# EAGLE design splitflap_02 (EAGLE 6.6.0)
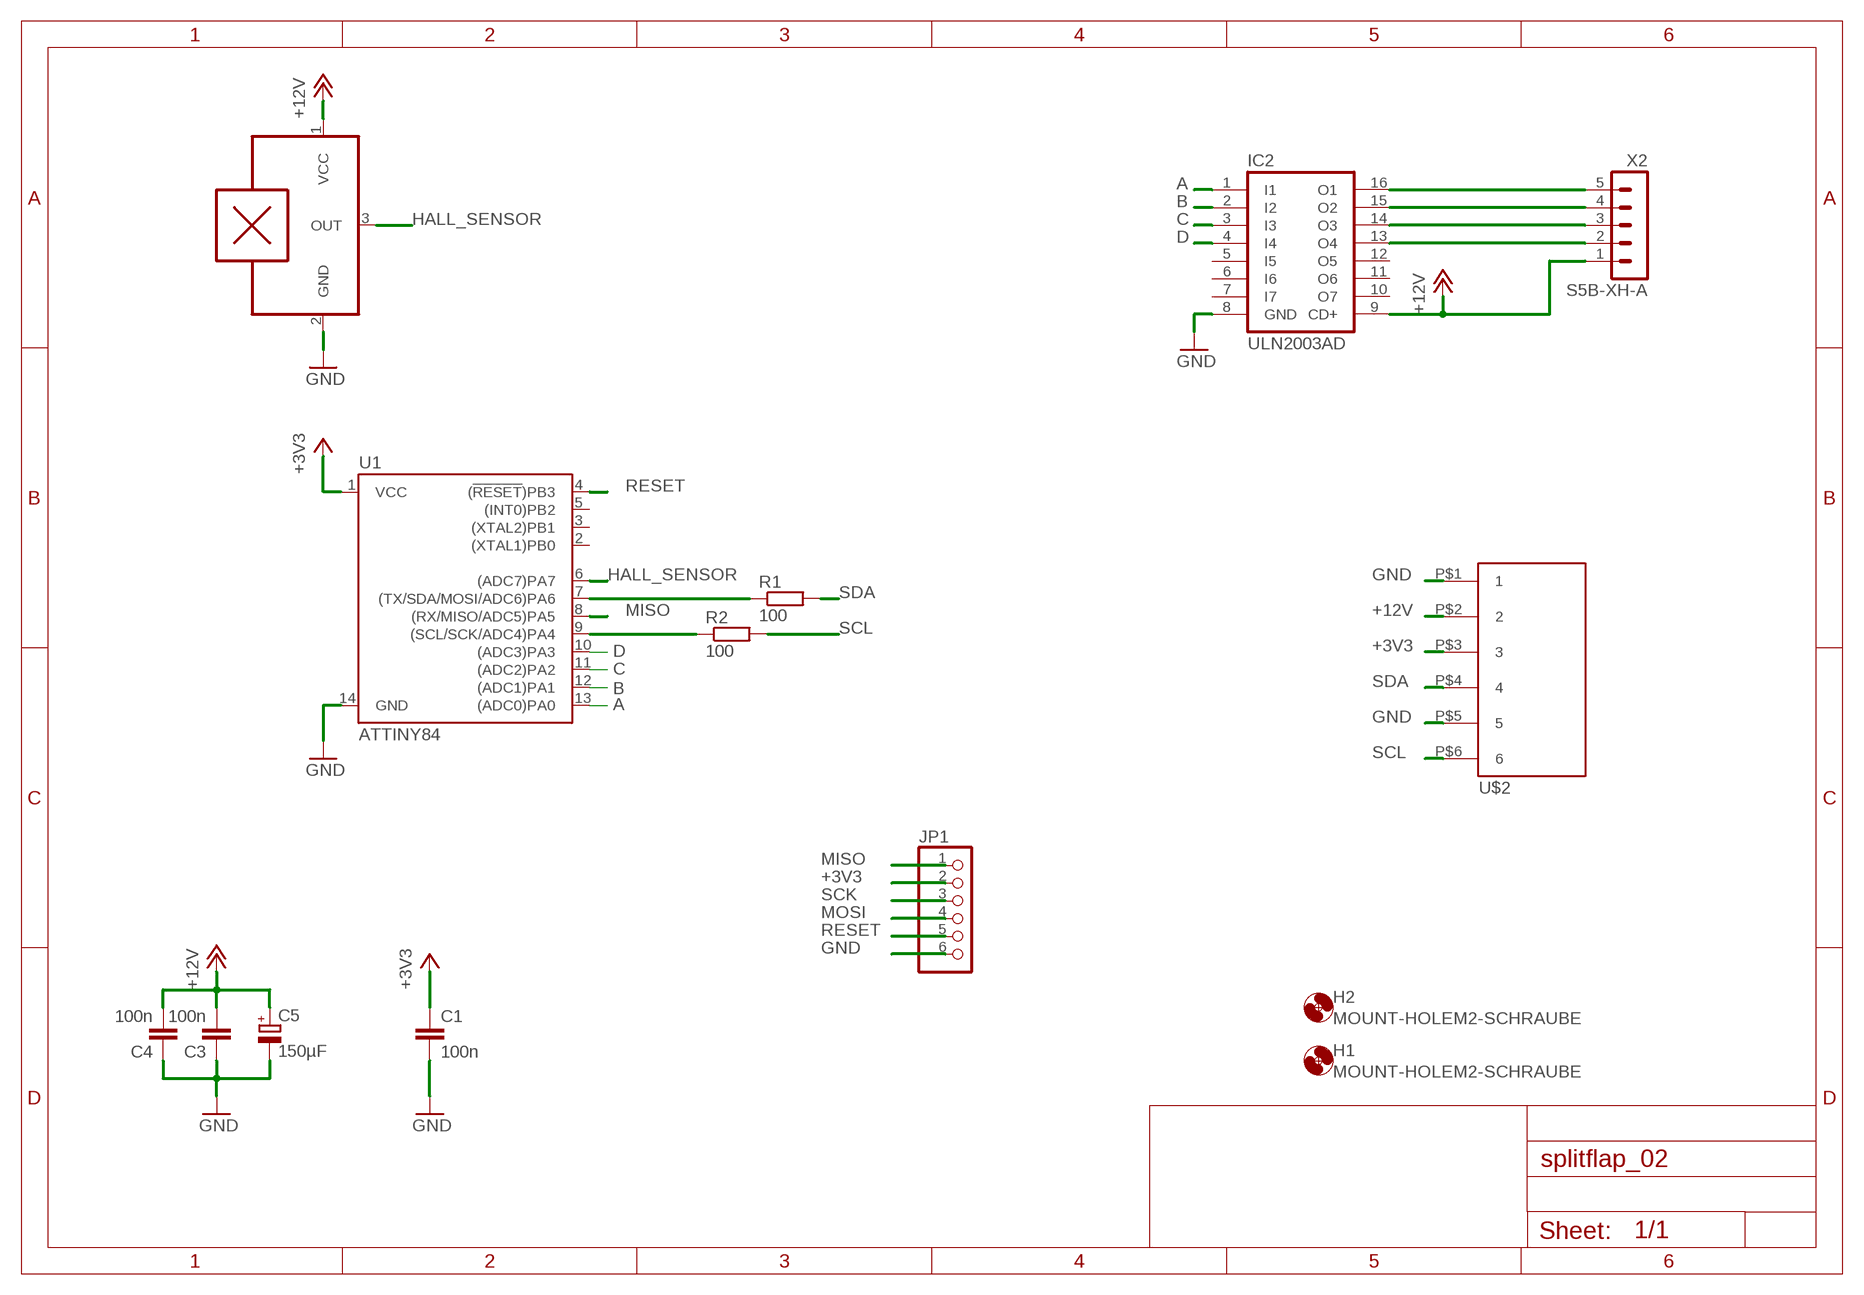
[diagram p0: schematic, sheet 1]

## Parts
C1  100n  C-EUC0805  [C0805]
C3  100n  C-EUC0805  [C0805]
C4  100n  C-EUC0805  [C0805]
C5  150µF  CPOL-EUSMCD  [SMC_D]
H1  MOUNT-HOLEM2-SCHRAUBE  [M2-SCHRAUBE]
H2  MOUNT-HOLEM2-SCHRAUBE  [M2-SCHRAUBE]
IC2  ULN2003AD  [SO16]
JP1  PINHD-1X6M  [1X06M]
R1  100  R-EU_R0805  [R0805]
R2  100  R-EU_R0805  [R0805]
U1  ATTINY84  [SO14]
U$1  A3144  [TO-92-LINE]
U$2  AMP-MICROMATCH-06  [AMP-MICROMATCH-06]
X2  S5B-XH-A  [S5B-XH-A]

## Nets
+3V3: C1.1 JP1.2 U1.1(VCC) U$2.P$3
+12V: C3.2 C4.2 C5.+ IC2.9(CD+) U$1.1(VCC) U$2.P$2 X2.1
A: IC2.1(I1) U1.13((ADC0)PA0)
B: IC2.2(I2) U1.12((ADC1)PA1)
C: IC2.3(I3) U1.11((ADC2)PA2)
D: IC2.4(I4) U1.10((ADC3)PA3)
GND: C1.2 C3.1 C4.1 C5.- IC2.8(GND) JP1.6 U1.14(GND) U$1.2(GND) U$2.P$1 U$2.P$5
HALL_SENSOR: U1.6((ADC7)PA7) U$1.3(OUT)
MISO: JP1.1 U1.8((RX/MISO/ADC5)PA5)
MOSI: JP1.4 R1.1 U1.7((TX/SDA/MOSI/ADC6)PA6)
N$3: IC2.16(O1) X2.5
N$4: IC2.15(O2) X2.4
N$5: IC2.14(O3) X2.3
N$6: IC2.13(O4) X2.2
RESET: JP1.5 U1.4((!RESET!)PB3)
SCK: JP1.3 R2.1 U1.9((SCL/SCK/ADC4)PA4)
SCL: R2.2 U$2.P$6
SDA: R1.2 U$2.P$4
Unconnected: IC2.5(I5) IC2.6(I6) IC2.7(I7) IC2.10(O7) IC2.11(O6) IC2.12(O5) U1.2((XTAL1)PB0) U1.3((XTAL2)PB1) U1.5((INT0)PB2)

## Library data of the parts
C1 C3 C4 = my_rcl:C-EU: CAPACITOR, European symbol
C5 = my_rcl:CPOL-EU: POLARIZED CAPACITOR, European symbol
H1 H2 = my_mount:MOUNT-HOLE: MOUNTING HOLE with drill center marker
IC2 = uln-udn:ULN2003A: DRIVER ARRAY
JP1 = my_pinhead:PINHD-1X6: PIN HEADER
R1 R2 = my_rcl:R-EU_: RESISTOR, European symbol
U1 = SparkFun-IC-Microcontroller:ATTINY84: Atmel 14-pin 2/4/8kB flash uC Datasheet <https://cdn.sparkfun.com/datasheets/Widgets/doc8006.pdf> SparkFun Products Tiny AVR Programmer <https://www.sparkfun.com/products/11801> (PGM-11801) SparkFun Servo Trigger - Continuous Rotation <https://www.sparkfun.com/products/13872> (WIG-13872) SparkFun Servo Trigger <https://www.sparkfun.com/products/13118> (WIG-13118); PROD_ID: IC-11285
U$1 = my_sensors:A3144
U$2 = my_connectors:AMP-MICROMATCH-06
X2 = con-JST XH:S5B-XH: JST XH series header 2.50mm pitch disconnectable crimp style connectors, horizontal (side entry type), 5 pins

## Board
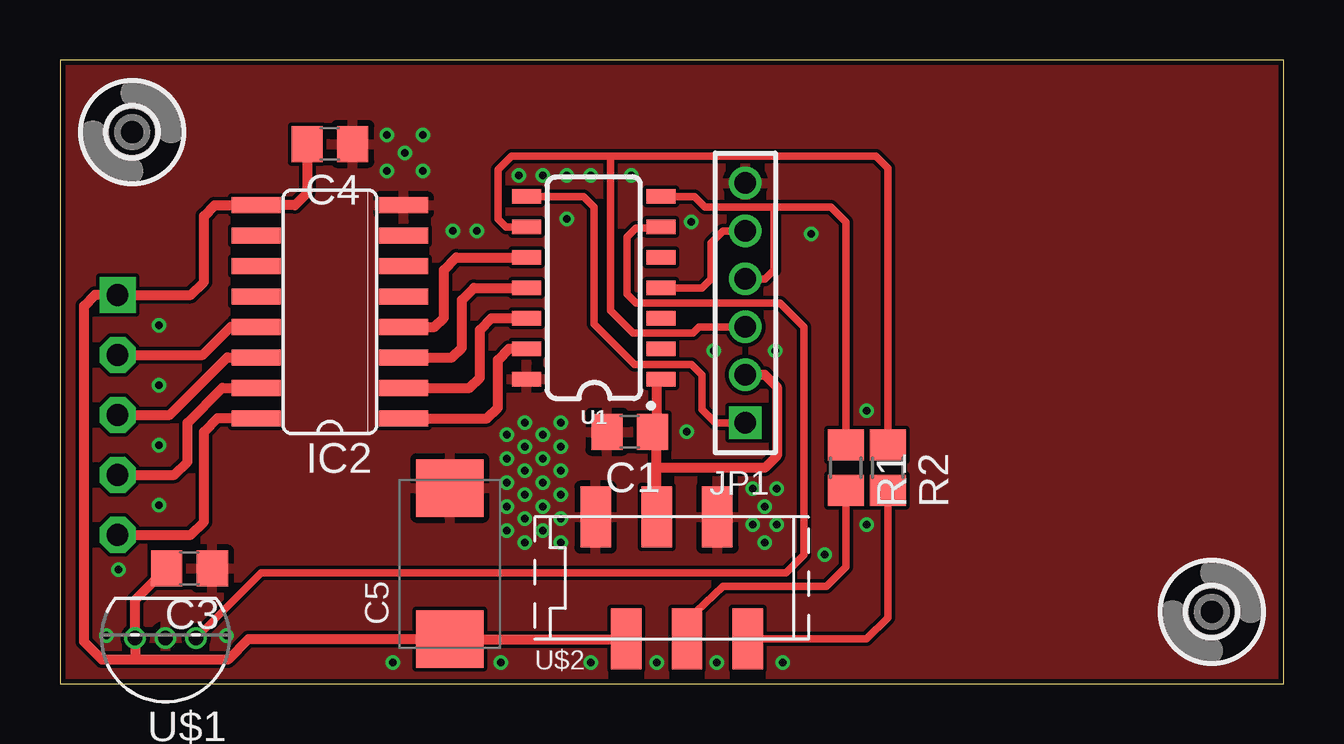
[diagram p1: board, top side]
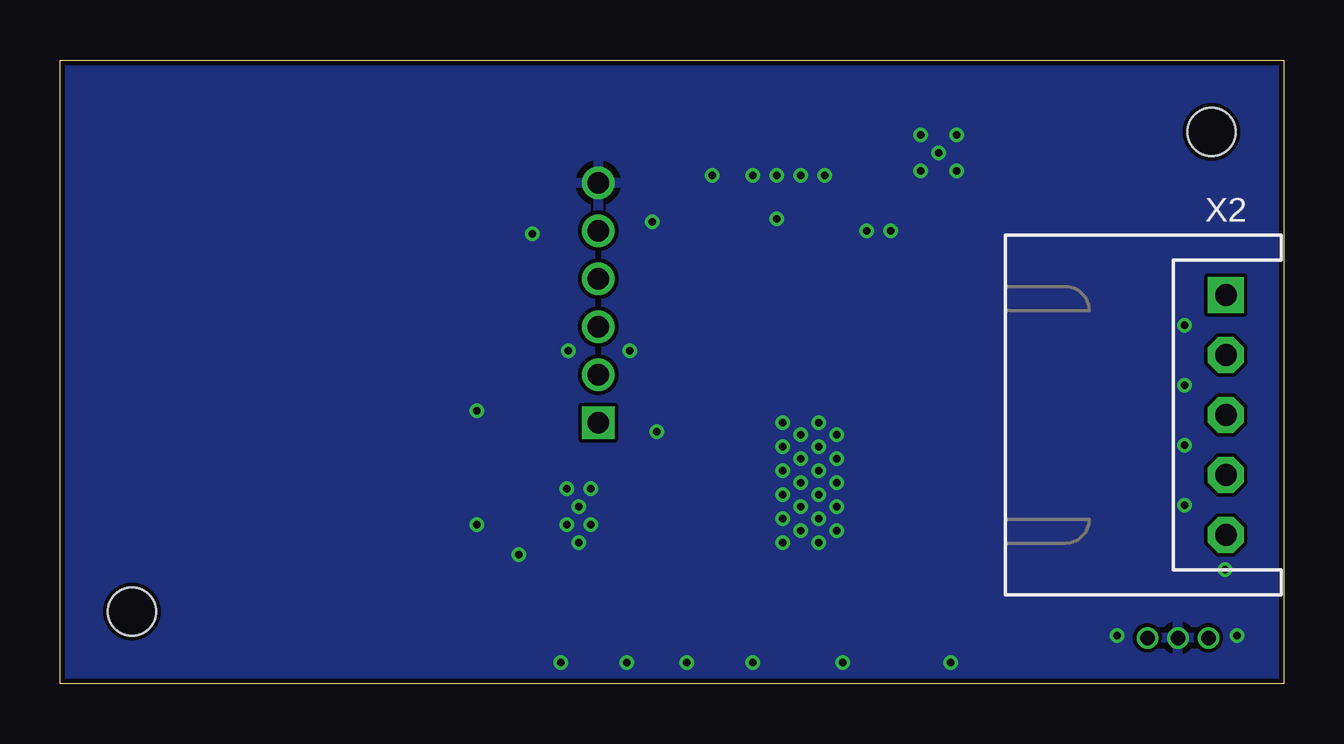
[diagram p2: board, bottom side, seen from below]

Size 51 x 26 mm. Coordinates in mm from the lower left corner, seen from the top.
Outline: 0,0 51,0 51,26 0,26 0,0
Copper layers (1*16): Top 0.035559375mm / dielectric 1.6mm / Bottom 0.035559375mm
Design rules "jlcpcb2layer *": minimum track width 6mil, minimum drill 0.3mm, track to track 6mil, track to pad 6mil, pad to pad 6mil, via to via 6mil, smd to smd 6mil, copper to edge 8mil, drill to drill 6mil, minimum pad ring 6mil, minimum via ring 6mil, stop-mask expansion 2.5mil, vias tented up to drill 1000mil, thermal gap 10mil

### Footprints (pad centres in the part's own frame; a part is rotated, then mirrored left to right if it is on the bottom)
C0805 = smd 1.3 x 1.5: 1 -0.95,0; 2 0.95,0
SMC_D = smd 2.4 x 2.8: + -3.15,0; - 3.15,0
M2-SCHRAUBE = hole 2: 0,0
SO16 = smd 0.66 x 2.032: 1 -4.445,-3.073; 2 -3.175,-3.073; 3 -1.905,-3.073; 4 -0.635,-3.073; 5 0.635,-3.073; 6 1.905,-3.073; 7 3.175,-3.073; 8 4.445,-3.073; 9 4.445,3.073; 10 3.175,3.073; 11 1.905,3.073; 12 0.635,3.073; 13 -0.635,3.073; 14 -1.905,3.073; 15 -3.175,3.073; 16 -4.445,3.073
1X06M = drill 0.914 square: 1 -5,0 | drill 0.914: 2 -3,0; 3 -1,0; 4 1,0; 5 3,0; 6 5,0
R0805 = smd 1.3 x 1.5: 1 -0.95,0; 2 0.95,0
SO14 = smd 0.6 x 1.2: 1 -3.81,-2.8; 2 -2.54,-2.8; 3 -1.27,-2.8; 4 0,-2.8; 5 1.27,-2.8; 6 2.54,-2.8; 7 3.81,-2.8; 8 3.81,2.8; 9 2.54,2.8; 10 1.27,2.8; 11 0,2.8; 12 -1.27,2.8; 13 -2.54,2.8; 14 -3.81,2.8
TO-92-LINE = drill 0.6: 1 1.27,0; 2 0,0; 3 -1.27,0
AMP-MICROMATCH-06 = smd 1.27 x 2.54: P$1 -3.175,2.54; P$2 -1.905,-2.54; P$3 -0.635,2.54; P$4 0.635,-2.54; P$5 1.905,2.54; P$6 3.175,-2.54
S5B-XH-A = drill 0.9 pad 1.5 square: 1 5,0 | drill 0.9 pad 1.5 octagon: 2 2.5,0; 3 0,0; 4 -2.5,0; 5 -5,0

### Placement (x,y rotation side)
C1  23.75,10.5 180 top
C3  5.4,4.8 180 top
C4  11.25,22.5 180 top
C5  16.25,5 90 top
H1  48,3 0 top
H2  3,23 0 top
IC2  11.25,15.5 90 top
JP1  28.56,15.88 90 top
R1  32.75,9 270 top
R2  34.5,9 270 top
U1  22.25,16.5 90 top
U$1  4.4,1.9 180 top
U$2  25.5,4.4 0 top
X2  2.4,11.2 90 bottom

### Tracks (layer width: path | path; a pad name or v marks a point on that pad's centre or on a via)
+3V3
  Top 0.406: U$2.P$3 24.86,9 | 24.86,9 24.86,10.5 | 24.86,10.5 C1.1 | U1.1 arc90 24.86,12.51 24.86,10.5 | 24.86,9 29.38,9 29.88,9.5 29.88,12.38 29.38,12.88 JP1.2
+12V
  Top 0.406: U$2.P$2 | C4.2 10.3,20.45 9.79,19.95 IC2.9 6.45,19.95 6,19.5 6,16.75 5.45,16.2 X2.1 1.45,16.2 1,15.75 1,1.75 1.75,1 3.13,1 | 23.59,1 U$2.P$2 | 3.13,1 U$1.1 3.13,3.48 C3.2 | 3.13,1 7,1 7.85,1.85 C5.+ U$2.P$2
A
  Top 0.406: IC2.1 17.8,11.05 18.25,11.5 18.25,13.5 18.71,13.96 U1.13
B
  Top 0.406: IC2.2 17.07,12.32 17.5,12.75 17.5,14.75 17.98,15.23 U1.12
C
  Top 0.406: IC2.3 16.34,13.6 16.75,14 16.75,16 17.25,16.5 U1.11
D
  Top 0.406: IC2.4 15.62,14.87 16,15.25 16,17.25 16.52,17.77 U1.10
GND  (via drill 0.3)
  Top 0.406: U$2.P$1 22,6.94
  other vias: 13.62,22.88 15.12,22.88 14.38,22.12 13.62,21.38 15.12,21.38 19.12,21.19 20.12,21.19 21.12,21.19 22.12,21.19 19.38,10.88 20.88,10.88 18.62,10.38 20.12,10.38 19.38,9.88 20.88,9.88 28.88,8.12 29.88,8.12 29.38,7.38 28.88,6.62 29.88,6.62 29.38,5.88 20.88,6.88 20.88,7.88 20.88,5.88 20.12,6.38 20.12,7.38 19.38,7.88 19.38,6.88 19.38,5.88 18.62,6.38 18.62,7.38 18.62,8.38 20.12,8.38 19.38,8.88 20.88,8.88 18.62,9.38 20.12,9.38 33.62,6.62 27.38,0.88 24.88,0.88 22.12,0.88 18.38,0.88 6.94,2 1.94,2 2.44,4.75 4.12,7.44 4.12,9.94 4.12,12.44 4.12,14.94 31.88,5.38 31.31,18.75 26.31,19.25 26.12,10.5 27.25,13.88 29.81,13.88 13.88,0.88 30.12,0.88 33.62,11.38 23.81,21.19 21.12,19.38 17.38,18.88 16.38,18.88
  pour Bottom: 0,0 51,0 51,26 0,26
  pour Top: 0,0 51,0 51,26 0,26
HALL_SENSOR
  Top 0.2: 25.05,19 U1.6
  Top 0.305: 25.05,19 24,19 23.62,18.62 23.62,16.25 24,15.88 30,15.88 31,14.88 31,5.38 30.25,4.62 8.39,4.62 U$1.3
MISO
  Top 0.305: U1.8 21.82,20.31 22.25,19.88 22.25,15 23.94,13.31 26.31,13.31 26.75,12.88 26.75,11.44 27.31,10.88 JP1.1
MOSI
  Top 0.305: U1.7 26.44,20.31 26.88,19.88 29.75,19.88 | 29.75,19.88 29.75,17.25 29.38,16.88 JP1.4 | R1.1 32.75,19.25 32.12,19.88 29.75,19.88
N$3
  Top 0.406: IC2.16 6.55,11.05 6,10.5 6,6.75 5.45,6.2 X2.5
N$4
  Top 0.406: X2.4 4.76,8.7 5.31,9.25 5.31,10.88 6.76,12.32 IC2.15
N$5
  Top 0.406: X2.3 4.58,11.2 6.97,13.6 IC2.14
N$6
  Top 0.406: X2.2 5.95,13.7 7.12,14.87 IC2.13
RESET
  Top 0.305: U1.4 26.75,16.5 27.12,16.88 27.12,18.38 27.62,18.88 JP1.5
SCK
  Top 0.305: U1.9 18.59,19.04 18.25,19.38 18.25,21.44 18.81,22 22.94,22 | 22.94,22 22.94,15.56 23.88,14.62 26.38,14.62 26.62,14.88 JP1.3 | R2.1 34.5,21.5 34,22 22.94,22
SCL
  Top 0.305: U$2.P$6 33.61,1.86 34.5,2.75 R2.2
SDA
  Top 0.305: U$2.P$4 26.14,2.63 27.62,4.06 31.94,4.06 32.75,4.88 R1.2

### Text on the board
tStop: ProjektionTV | 2598 | ProjektionTV